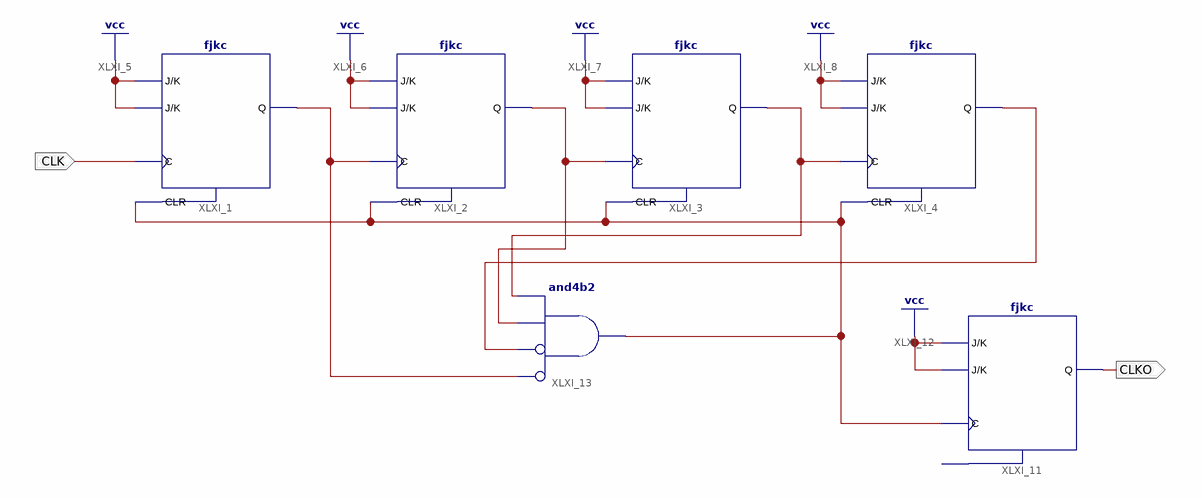
[diagram p0: schematic sheet 1]
// Xilinx ISE schematic clkdiv20.sch (spartan6) as structural Verilog: 6 symbols, 2 ports
module clkdiv20 (
  input  CLK,
  output CLKO
);

  wire XLXN_9, XLXN_10, XLXN_14, XLXN_15, XLXN_23;

  fjkc XLXI_1 (.C(CLK), .CLR(XLXN_14), .J(1'b1), .K(1'b1), .Q(XLXN_9));
  fjkc XLXI_2 (.C(XLXN_9), .CLR(XLXN_14), .J(1'b1), .K(1'b1), .Q(XLXN_10));
  fjkc XLXI_3 (.C(XLXN_10), .CLR(XLXN_14), .J(1'b1), .K(1'b1), .Q(XLXN_15));
  fjkc XLXI_4 (.C(XLXN_15), .CLR(XLXN_14), .J(1'b1), .K(1'b1), .Q(XLXN_23));
  fjkc XLXI_11 (.C(XLXN_14), .J(1'b1), .K(1'b1), .Q(CLKO));  // open: CLR
  and XLXI_13 (XLXN_14, ~XLXN_9, ~XLXN_23, XLXN_10, XLXN_15);  // and4b2
endmodule
